# EAGLE design weather-cube_wifi_controller (EAGLE 7.7.0)
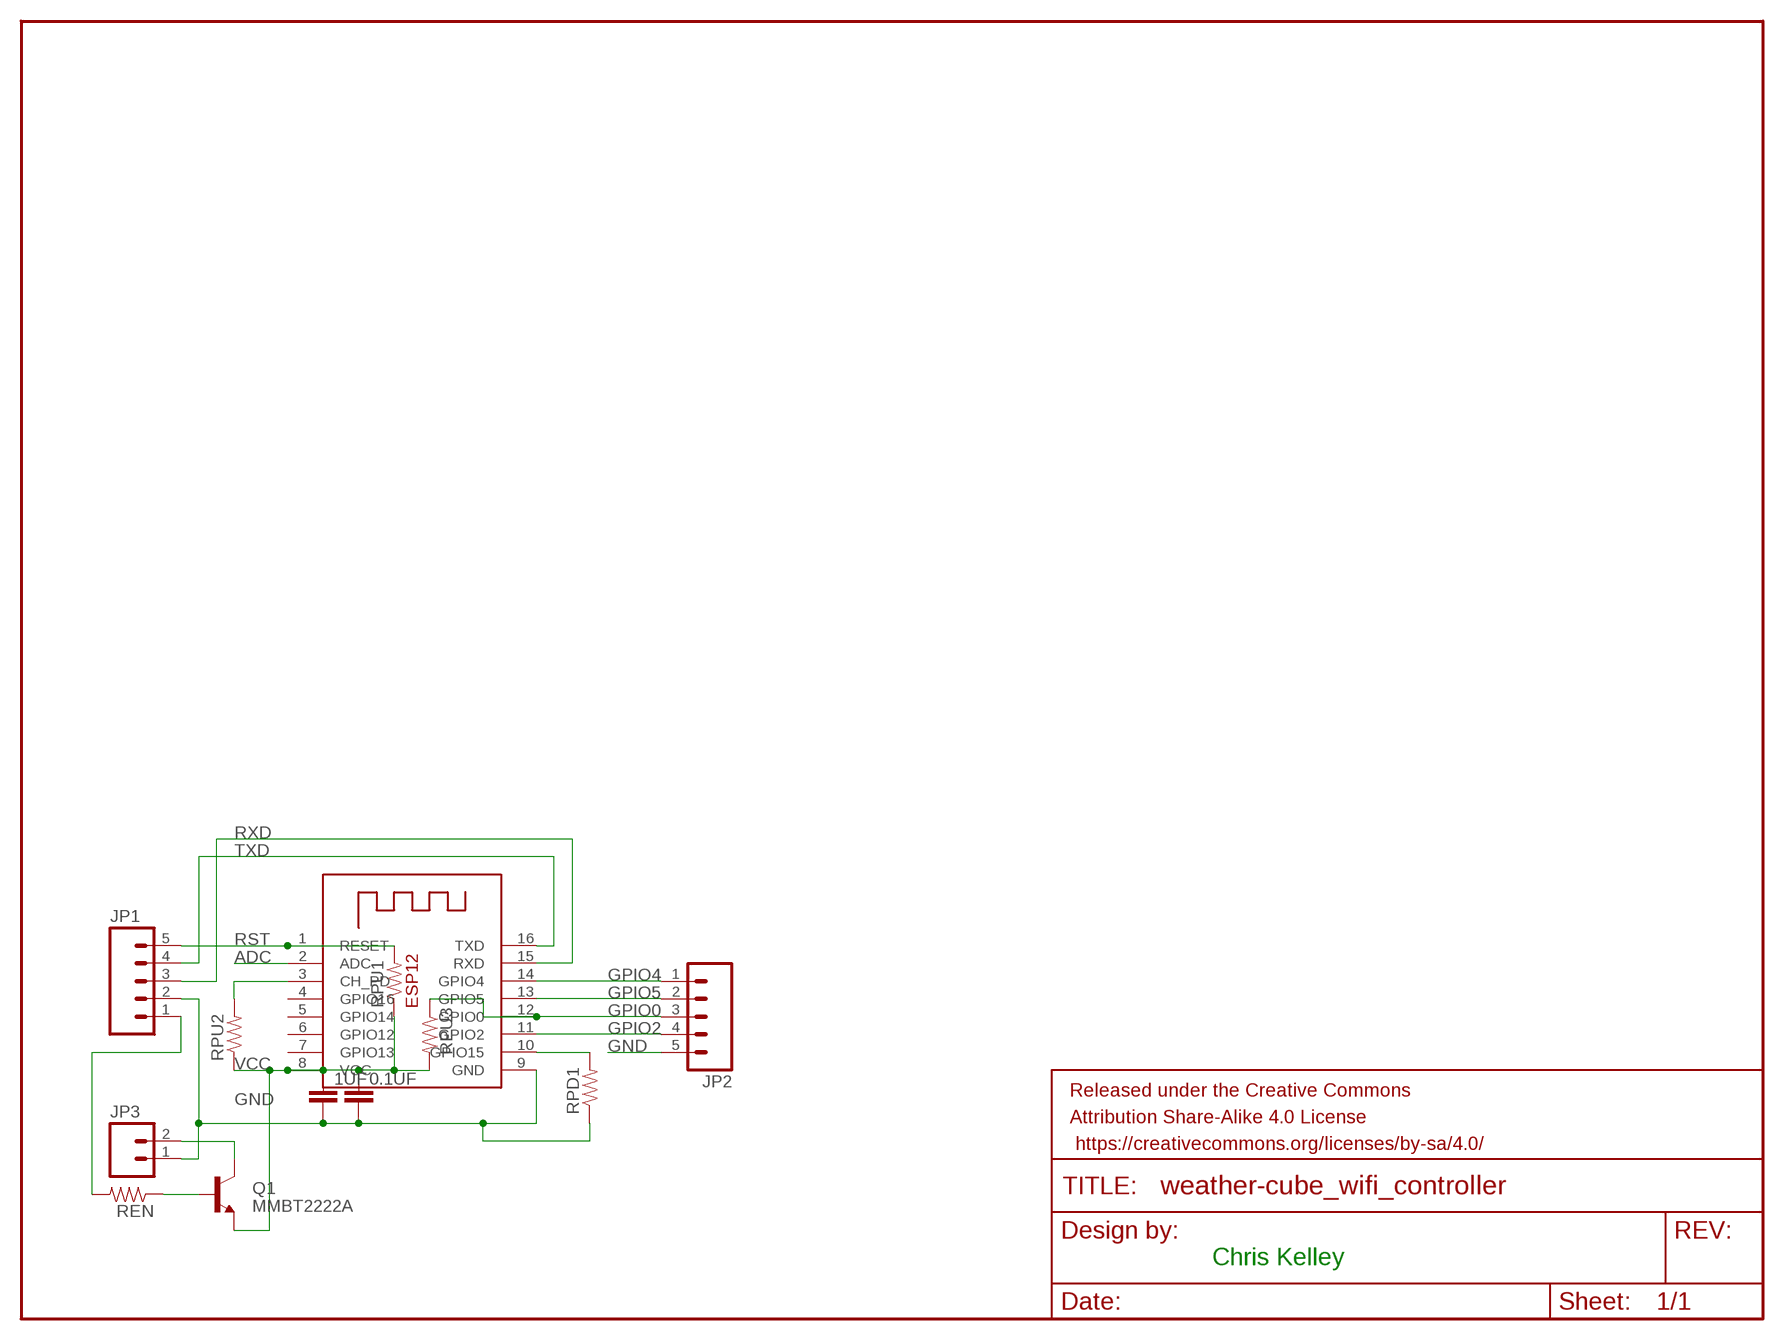
[diagram p0: schematic, sheet 1]

## Parts
0.1UF  CAP0603-CAP  [0603-CAP]
1UF  CAP0603-CAP  [0603-CAP]
FRAME1  FRAME-LETTER  [CREATIVE_COMMONS]
JP1  M05PTH  [1X05]
JP2  M05PTH  [1X05]
JP3  M02PTH  [1X02]
Q1  MMBT2222A  TRANSISTOR_NPNMMBT2222A  [SOT23-3]
REN  RESISTOR0603-RES  [0603-RES]
RPD1  RESISTOR0603-RES  [0603-RES]
RPU1  RESISTOR0603-RES  [0603-RES]
RPU2  RESISTOR0603-RES  [0603-RES]
RPU3  RESISTOR0603-RES  [0603-RES]
X1  ESP-12  [ESP-12]

## Nets
ADC: X1.2(ADC)
CH_PD: RPU2.2 X1.3(CH_PD)
GND: 0.1UF.2 1UF.2 JP1.2 JP2.5 JP3.1 RPD1.1 X1.9(GND)
GPIO0: JP2.3 RPU3.1 X1.12(GPIO0)
GPIO2: JP2.4 X1.11(GPIO2)
GPIO4: JP2.1 X1.14(GPIO4)
GPIO5: JP2.2 X1.13(GPIO5)
GPIO15: RPD1.2 X1.10(GPIO15)
N$2: JP1.1 REN.2
N$3: Q1.1(B) REN.1
RST: JP1.5 RPU1.2 X1.1(RESET)
RXD: JP1.3 X1.15(RXD)
TXD: JP1.4 X1.16(TXD)
VCC: 0.1UF.1 1UF.1 Q1.2(E) RPU1.1 RPU2.1 RPU3.2 X1.8(VCC)
VEXT: JP3.2 Q1.3(C)
Unconnected: X1.4(GPIO16) X1.5(GPIO14) X1.6(GPIO12) X1.7(GPIO13)

## Notes on the sheet
- Chris Kelley

## Library data of the parts
0.1UF 1UF = SparkFun-Passives:CAP: Capacitor Standard 0603 ceramic capacitor, and 0.1" leaded capacitor.
FRAME1 = SparkFun-Aesthetics:FRAME-LETTER: Schematic Frame Standard 8.5x11 US Letter frame
JP1 JP2 = SparkFun-Connectors:M05: Header 5 Standard 5-pin 0.1" header. Use with straight break away headers (SKU : PRT-00116), right angle break away headers (PRT-00553), swiss pins (PRT-00743), machine pins (PRT-00117), and female headers (PRT-00115). Molex polarized connector foot print use with SKU : PRT-08230 with associated crimp pins and housings.
JP3 = SparkFun-Connectors:M02: Standard 2-pin 0.1" header. Use with - straight break away headers ( PRT-00116) - right angle break away headers (PRT-00553) - swiss pins (PRT-00743) - machine pins (PRT-00117) - female headers (PRT-00115) Molex polarized connector foot print use with: PRT-08233 with associated crimp pins and housings. 2.54_SCREWTERM for use with PRT-10571. 3.5mm Screw Terminal footprints for PRT-08084 5mm Screw Terminal footprints for use with PRT-08432
Q1 = SparkFun-DiscreteSemi:TRANSISTOR_NPN: Generic NPN BJT MMBT2222A - TRANS-08049 (SOT-23, 1A 40V) MPSA42 - TRANS-09116 (SOT-23, 500mA 300V) MMBT5088LT1G - TRANS-11160 (SOT-23, 50 mA 30V) BC547 - COM-08928 <http://www.sparkfun.com/products/8928> (TO-92 45V 100mA) (1.Collector 2.Base 3.Emitter) 2N3904 - COM-00521 <http://www.sparkfun.com/products/521> (TO-92 40V 200mA) (1.Emitter 2.Base 3.Collector) P2N2222A - COM-12852 <http://www.sparkfun.com/products/12852> (TO-92 40V 600mA) (1.Collector 2.Base 3.Emitter); PROD_ID: TRANS-08049
REN RPD1 RPU1-RPU3 = SparkFun-Passives:RESISTOR: Resistor Basic schematic elements and footprints for 0603, 1206, and PTH resistors.
X1 = adafruit:ESP-12

## Board
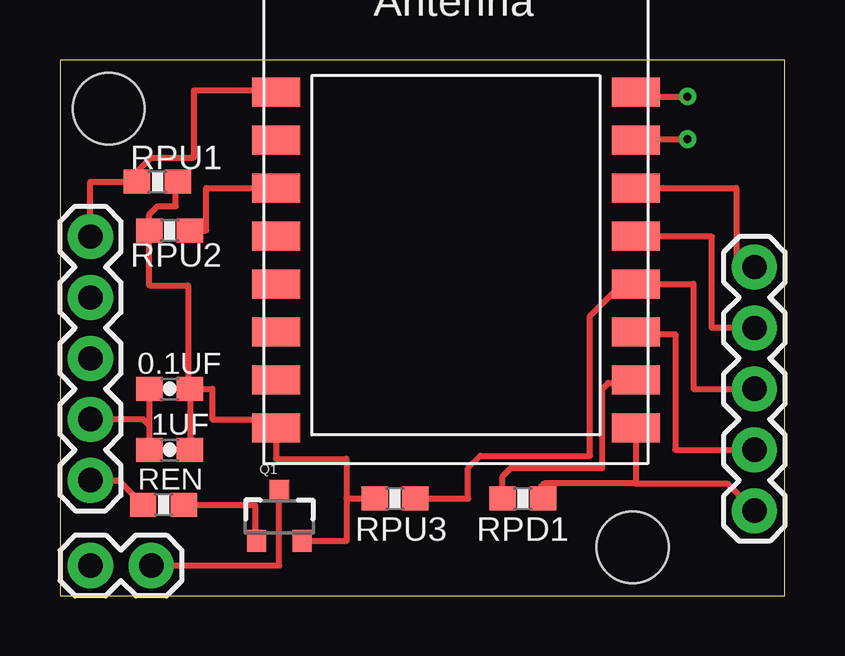
[diagram p1: board, top side]
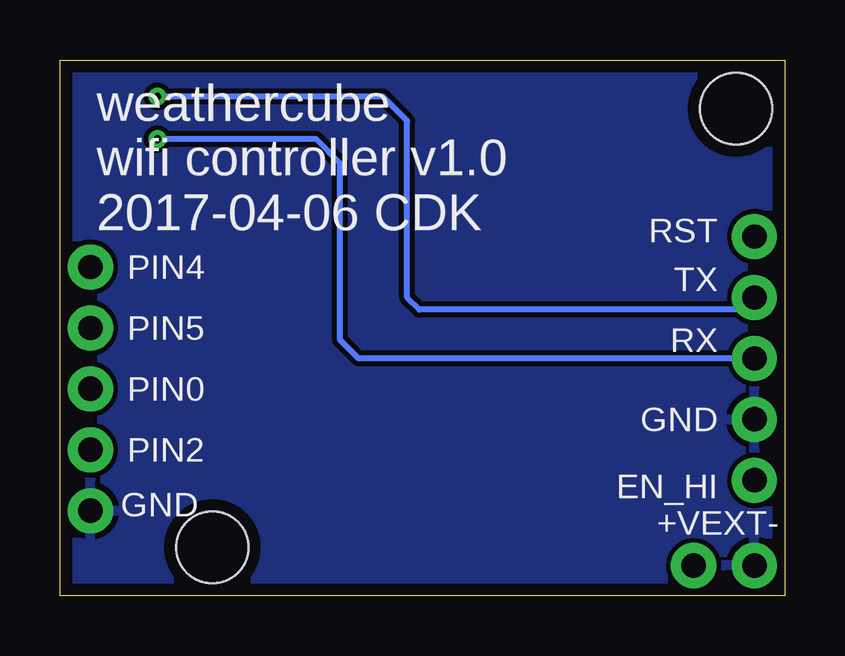
[diagram p2: board, bottom side, seen from below]

Size 30.23 x 22.35 mm. Coordinates in mm from the lower left corner, seen from the top.
Outline: 0,0 30.23,0 30.23,22.35 0,22.34 0,0
Copper layers (1*16): Top 0.035mm / dielectric 1.5mm / Bottom 0.035mm
Design rules "default *": minimum track width 10mil, minimum drill 24mil, track to track 8mil, track to pad 8mil, pad to pad 8mil, via to via 8mil, smd to smd 8mil, copper to edge 20mil, drill to drill 8mil, minimum pad ring 10mil, minimum via ring 8mil, stop-mask expansion 4mil, vias tented up to drill 13mil, thermal gap 10mil
Holes 3 mm at 2.03,20.32 23.88,2.03

### Footprints (pad centres in the part's own frame; a part is rotated, then mirrored left to right if it is on the bottom)
0603-CAP = smd 1.1 x 1: 1 -0.85,0; 2 0.85,0
1X05 = drill 1.016 pad 1.88: 1 0,0; 2 2.54,0; 3 5.08,0; 4 7.62,0; 5 10.16,0
1X02 = drill 1.016 pad 1.88: 1 0,0; 2 2.54,0
SOT23-3 = smd 0.8 x 0.9: 1 -0.95,-1; 2 0.95,-1; 3 0,1.1
0603-RES = smd 1.1 x 1: 1 -0.85,0; 2 0.85,0
ESP-12 = smd 2 x 1.2: 1 -7.5,4.5; 2 -7.5,2.5; 3 -7.5,0.5; 4 -7.5,-1.5; 5 -7.5,-3.5; 6 -7.5,-5.5; 7 -7.5,-7.5; 8 -7.5,-9.5; 9 7.5,-9.5; 10 7.5,-7.5; 11 7.5,-5.5; 12 7.5,-3.5; 13 7.5,-1.5; 14 7.5,0.5; 15 7.5,2.5; 16 7.5,4.5

### Placement (x,y rotation side)
0.1UF  4.57,8.64 180 top
1UF  4.57,6.1 180 top
FRAME1  -7.62,-27.94 0 top  (outside the outline)
JP1  1.27,4.83 90 top
JP2  28.96,13.72 270 top
JP3  1.27,1.27 0 top
Q1  9.14,3.3 0 top
REN  4.32,3.81 180 top
RPD1  19.3,4.06 180 top
RPU1  4.06,17.27 180 top
RPU2  4.57,15.24 0 top
RPU3  13.97,4.06 180 top
X1  16.51,16.51 0 top

### Tracks (layer width: path | path; a pad name or v marks a point on that pad's centre or on a via)
CH_PD
  Top 0.254: RPU2.2 6.1,15.24 6.1,17.02 X1.3
GND
  Top 0.254: 3.72,7.11 0.1UF.2 3.72,8.29 | 3.72,7.11 1UF.2 | JP1.2 3.47,7.37 3.72,7.11 | X1.9 24.01,4.69 | 24.01,4.69 20.19,4.69 20.07,4.57 20.07,4.15 RPD1.1 | 24.01,4.69 27.82,4.69 JP2.5
  pour Bottom: -5.33,25.15 38.86,25.15 38.86,-7.87 -5.33,-7.87
GPIO0
  Top 0.254: JP2.3 26.42,8.64 26.42,13.01 X1.12 23.95,12.95 23.37,12.95 22.1,11.68 22.1,5.84 17.53,5.84 17.02,5.33 17.02,4.06 RPU3.1
GPIO2
  Top 0.254: X1.11 24.04,10.92 25.65,10.92 25.65,6.1 JP2.4
GPIO4
  Top 0.254: X1.14 25.15,17.01 28.19,17.02 28.19,13.72 JP2.1
GPIO5
  Top 0.254: JP2.2 27.18,11.18 27.18,14.99 24.03,14.99 X1.13
GPIO15
  Top 0.254: RPD1.2 18.45,4.99 18.8,5.33 22.61,5.33 22.61,8.64 22.86,8.89 23.89,8.89 X1.10
N$2
  Top 0.254: JP1.1 2.45,4.83 REN.2
N$3
  Top 0.254: REN.1 8.13,3.81 8.13,2.29 Q1.1
RST
  Top 0.254: JP1.5 1.27,17.27 RPU1.2 3.21,17.69 3.81,18.29 5.59,18.29 5.59,21.08 8.94,21.08 X1.1
RXD  (via drill 0.33)
  Top 0.254: X1.15 24.6,19.05 v26.16,19.05
  Bottom 0.254: JP1.3 17.78,9.91 18.54,10.67 18.54,18.03 19.56,19.05 v26.16,19.05
TXD  (via drill 0.33)
  Top 0.254: X1.16 24.2,20.83 v26.16,20.83
  Bottom 0.254: JP1.4 1.27,11.94 15.24,11.94 15.75,12.45 15.75,19.81 16.76,20.83 v26.16,20.83
VCC
  Top 0.254: 5.33,6.01 1UF.1 0.1UF.1 | 0.1UF.1 6.35,8.64 6.35,7.37 8.65,7.37 X1.8 9.01,5.72 11.94,5.72 11.94,4.06 | 0.1UF.1 5.33,8.72 5.33,12.95 3.72,12.95 RPU2.1 3.72,15.91 4.06,16.26 4.83,16.26 4.83,17.18 RPU1.1 | 11.94,4.06 RPU3.2 | 11.94,4.06 11.94,2.29 10.36,2.29 Q1.2
VEXT
  Top 0.254: JP3.2 9.14,1.27 Q1.3

### Text on the board
bPlace: weathercube / wifi controller v1.0 / 2017-04-06 CDK
tNames: Chris Kelley
bNames: RST | TX | PIN4 | RX | PIN5 | GND | PIN0 | PIN2 | EN_HI | +VEXT- | GND